# EAGLE design POWERSUPPLY (EAGLE 9.6.2)
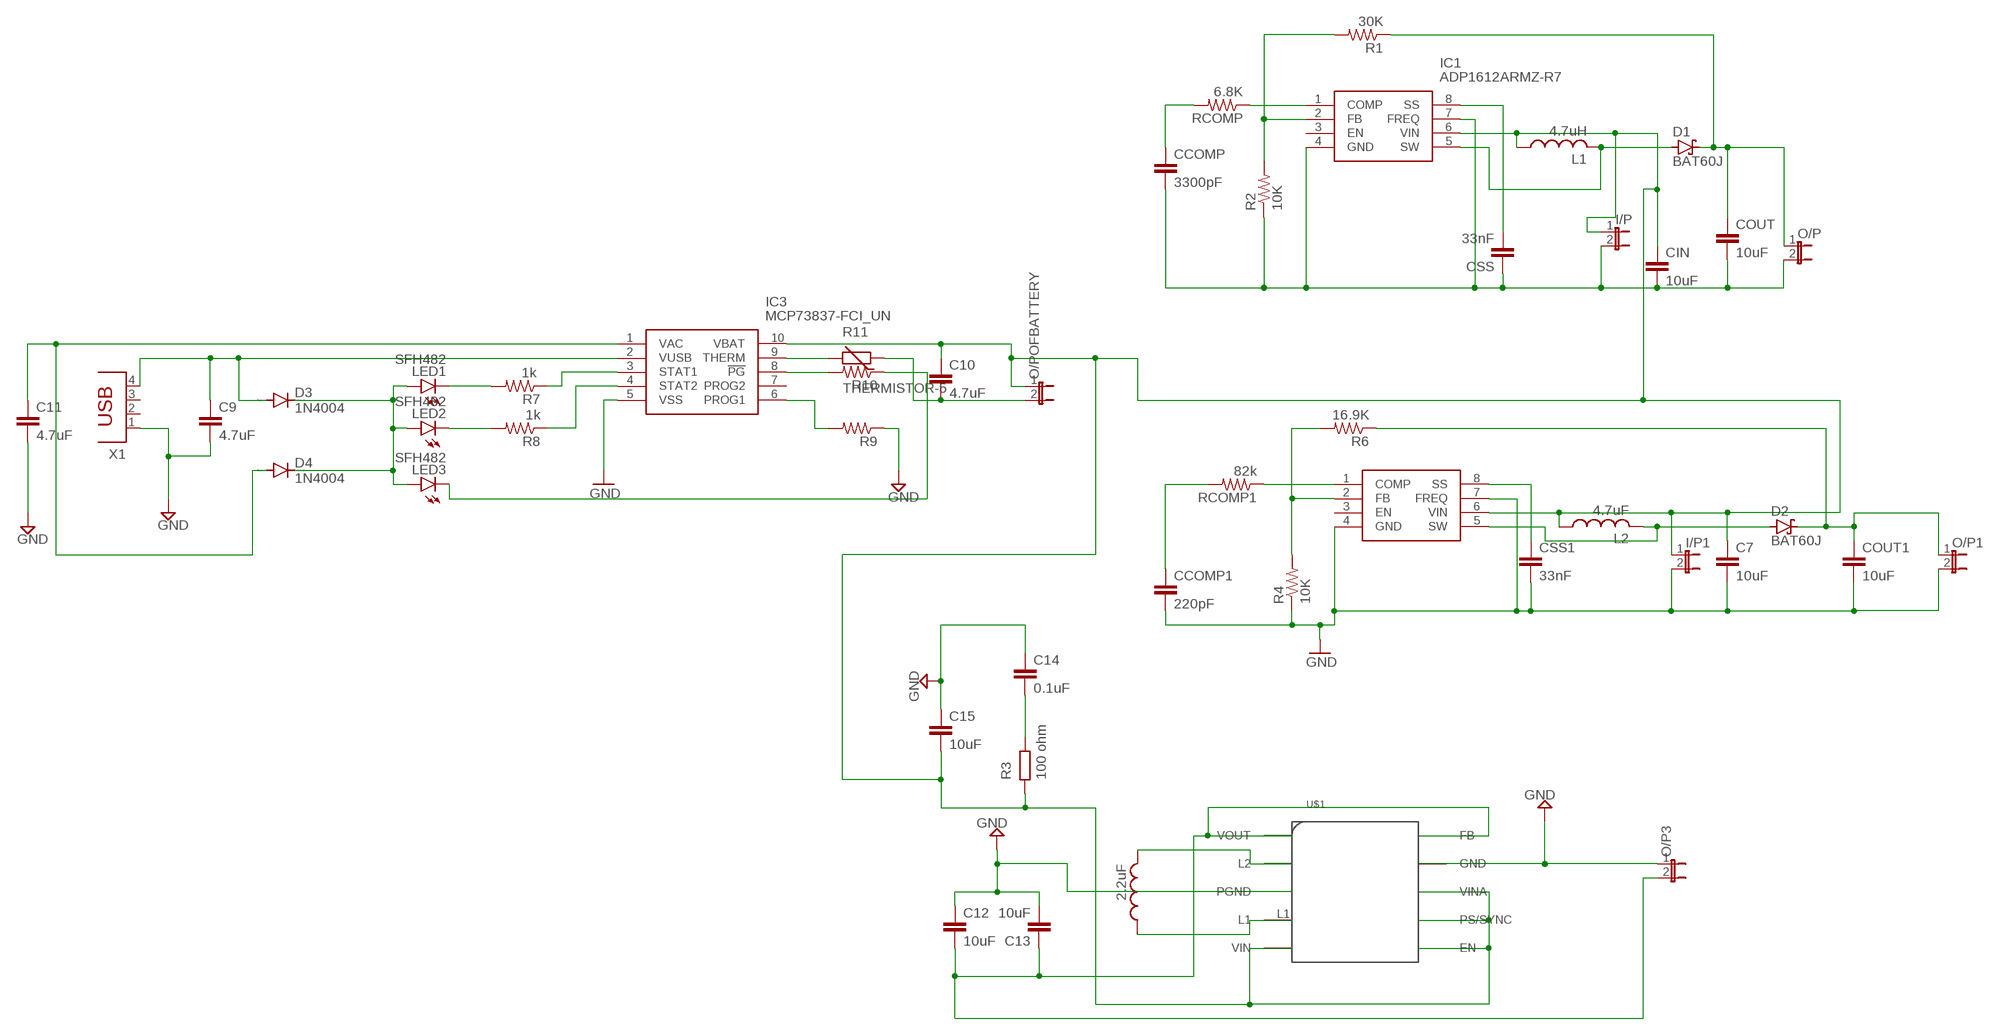
[diagram p0: schematic, sheet 1]

## Parts
C7  10uF  C2,5-3  [C2.5-3]
C9  4.7uF  C2,5-3  [C2.5-3]
C10  4.7uF  C2,5-3  [C2.5-3]
C11  4.7uF  C2,5-3  [C2.5-3]
C12  10uF  C2,5-3  [C2.5-3]
C13  10uF  C2,5-3  [C2.5-3]
C14  0.1uF  C2,5-3  [C2.5-3]
C15  10uF  C2,5-3  [C2.5-3]
CCOMP  3300pF  C2,5-3  [C2.5-3]
CCOMP1  220pF  C2,5-3  [C2.5-3]
CIN  10uF  C2,5-3  [C2.5-3]
COUT  10uF  C2,5-3  [C2.5-3]
COUT1  10uF  C2,5-3  [C2.5-3]
CSS  33nF  C2,5-3  [C2.5-3]
CSS1  33nF  C2,5-3  [C2.5-3]
D1  BAT60J  [SOD323_ST]
D2  BAT60J  [SOD323_ST]
D3  1N4004  [DO41-10]
D4  1N4004  [DO41-10]
I/P  JP1E  [JP1]
I/P1  JP1E  [JP1]
IC1  ADP1612ARMZ-R7  [SOP65P490X110-8N]
IC2  ADP1613ARMZ-R7  [SOP65P490X110-8N]
IC3  MCP73837-FCI_UN  [SOP50P490X110-10N]
L1  4.7uH  L-US0207/5V  [0207/5V]
L2  4.7uF  L-US0207/5V  [0207/5V]
L3  2.2uF  L-US0207/5V  [0207/5V]
LED1  SFH482  [SFH482]
LED2  SFH482  [SFH482]
LED3  SFH482  [SFH482]
O/P  JP1E  [JP1]
O/P1  3.3V  JP1E  [JP1]
O/P3  JP1E  [JP1]
O/POFBATTERY  JP1E  [JP1]
R1  30K  R-US_0204/7  [0204/7]
R2  10K  R-US_0204/7  [0204/7]
R3  100 ohm  R  (no package)
R4  10K  R-US_0204/7  [0204/7]
R6  16.9K  R-US_0204/7  [0204/7]
R7  1k  R-US_0204/7  [0204/7]
R8  1k  R-US_0204/7  [0204/7]
R9  R-US_0204/7  [0204/7]
R10  R-US_0204/7  [0204/7]
R11  THERMISTOR-5  [R-5]
RCOMP  6.8K  R-US_0204/7  [0204/7]
RCOMP1  82k  R-US_0204/7  [0204/7]
U$1  TPS63002  [TPS63002]
X1  PN87520  [PN87520]

## Nets
GND: C7.2 C9.2 C11.2 C12.1 C13.2 C14.1 C15.1 CCOMP1.2 COUT1.2 CSS1.2 I/P1.2 IC2.4(GND) IC2.7(FREQ) IC3.5(VSS) O/P1.2 O/P3.1 R4.1 R9.1 U$1.GND U$1.PGND X1.1
N$1: CCOMP.1 RCOMP.2
N$2: IC1.1(COMP) RCOMP.1
N$3: CCOMP.2 CIN.2 COUT.2 CSS.1 I/P.2 IC1.4(GND) IC1.7(FREQ) O/P.2 R2.1
N$4: IC1.2(FB) R1.2 R2.2
N$5: CSS.2 IC1.8(SS)
N$6: IC3.4(STAT2) R8.1
N$7: C7.1 C10.1 C15.2 CIN.1 I/P1.1 I/P.1 IC1.6(VIN) IC2.6(VIN) IC3.10(VBAT) L1.1 L2.1 O/POFBATTERY.1 R3.1 U$1.EN U$1.PS/SYNC U$1.VIN U$1.VINA
N$8: D1.A IC1.5(SW) L1.2
N$9: COUT.1 D1.C O/P.1 R1.1
N$10: CCOMP1.1 RCOMP1.2
N$11: IC2.1(COMP) RCOMP1.1
N$12: IC2.2(FB) R4.2 R6.2
N$13: CSS1.1 IC2.8(SS)
N$14: D2.A IC2.5(SW) L2.2
N$15: C11.1 D4.A IC3.1(VAC)
N$16: L3.2 U$1.L2
N$17: COUT1.1 D2.C O/P1.1 R6.1
N$19: C9.1 D3.A IC3.2(VUSB) X1.4
N$20: C12.2 C13.1 O/P3.2 U$1.FB U$1.VOUT
N$22: IC3.3(STAT1) R7.1
N$25: D3.C D4.C LED1.A LED2.A LED3.A
N$26: LED1.K(C) R7.2
N$27: LED2.K(C) R8.2
N$28: LED3.K(C) R10.1
N$30: IC3.6(PROG1) R9.2
N$31: L3.1 U$1.L1
N$32: IC3.9(THERM) R11.2
N$33: IC3.8(!PG) R10.2
N$34: C10.2 O/POFBATTERY.2 R11.1
N$38: C14.2 R3.2
Unconnected: IC1.3(EN) IC2.3(EN) IC3.7(PROG2) X1.2 X1.3

## Library data of the parts
C7 C9-C15 CCOMP CCOMP1 CIN COUT COUT1 CSS CSS1 = capacitor-wima:C: CAPACITOR naming: grid - package width
D1 D2 = diode:BAT60J: Schottky barrier diode Source: www.st.com, BAT60J.pdf
D3 D4 = diode:1N4004: DIODE general purpose rectifier, 1 A
I/P I/P1 O/P O/P1 O/P3 O/POFBATTERY = jumper:JP1E: JUMPER
IC1 = ADP1612ARMZ-R7:ADP1612ARMZ-R7: Analog Devices ADP1612ARMZ-R7, Step Up DC-DC Converter, 1.9A, Adjustable, 5.5 20 V, 8-Pin MSOP Source: Datasheet <http://uk.rs-online.com/web/p/products/7427727P>; ARROW_PART_NUMBER: ADP1612ARMZ-R7; ARROW_PRICE-STOCK: https://www.arrow.com/en/products/adp1612armz-r7/analog-devices; DESCRIPTION: Analog Devices ADP1612ARMZ-R7, Step Up DC-DC Converter, 1.9A, Adjustable, 5.5 20 V, 8-Pin MSOP; HEIGHT: 1.1mm; MANUFACTURER_NAME: Analog Devices; MANUFACTURER_PART_NUMBER: ADP1612ARMZ-R7; MOUSER_PART_NUMBER: 584-ADP1612ARMZ-R7; MOUSER_PRICE-STOCK: https://www.mouser.com/Search/Refine.aspx?Keyword=584-ADP1612ARMZ-R7
IC2 = ADP1613ARMZ-R7:ADP1613ARMZ-R7: Analog Devices ADP1613ARMZ-R7, Step Up DC-DC Converter, 2.5A, Adjustable, 5.5 20 V, 8-Pin MSOP Source: Datasheet <https://datasheet.lcsc.com/szlcsc/Analog-Devices-ADI-ADP1613ARMZ-R7_C132279.pdf>; ARROW_PART_NUMBER: ADP1613ARMZ-R7; ARROW_PRICE-STOCK: https://www.arrow.com/en/products/adp1613armz-r7/analog-devices; DESCRIPTION: Analog Devices ADP1613ARMZ-R7, Step Up DC-DC Converter, 2.5A, Adjustable, 5.5 20 V, 8-Pin MSOP; HEIGHT: 1.1mm; MANUFACTURER_NAME: Analog Devices; MANUFACTURER_PART_NUMBER: ADP1613ARMZ-R7; MOUSER_PART_NUMBER: 584-ADP1613ARMZ-R7; MOUSER_PRICE-STOCK: https://www.mouser.co.uk/ProductDetail/Analog-Devices/ADP1613ARMZ-R7?qs=WIvQP4zGanhDtCwLTFW%252BRw%3D%3D
IC3 = MCP73837-FCI_UN:MCP73837-FCI_UN: Li-Ion Charger USB/DC 4.2V 1A PG MSOP10 Source: Datasheet <http://ww1.microchip.com/downloads/en/DeviceDoc/22071B.pdf>; ARROW_PART_NUMBER: MCP73837-FCI/UN; ARROW_PRICE-STOCK: https://www.arrow.com/en/products/mcp73837-fciun/microchip-technology; DESCRIPTION: Li-Ion Charger USB/DC 4.2V 1A PG MSOP10; HEIGHT: 1.1mm; MANUFACTURER_NAME: Microchip; MANUFACTURER_PART_NUMBER: MCP73837-FCI/UN; MOUSER_PART_NUMBER: 579-MCP73837-FCI/UN; MOUSER_PRICE-STOCK: https://www.mouser.co.uk/ProductDetail/Microchip-Technology/MCP73837-FCI-UN?qs=hH%252BOa0VZEiDKGj395FRsiw%3D%3D
L1-L3 = rcl:L-US: INDUCTOR, American symbol; SPICEPREFIX: L
LED1-LED3 = led:SFH482: IR LED infrared emitting diode, Infineon
R1 R2 R4 R6-R10 RCOMP RCOMP1 = rcl:R-US_: RESISTOR, American symbol; SPICEPREFIX: R
R3 = ngspice-simulation:R: RESISTOR
R11 = varistor:THERMISTOR: THERMISTOR
U$1 = TPS63002:TPS63002
X1 = con-berg:PN87520: BERG USB connector; OC_FARNELL: unknown; OC_NEWARK: unknown

## Board
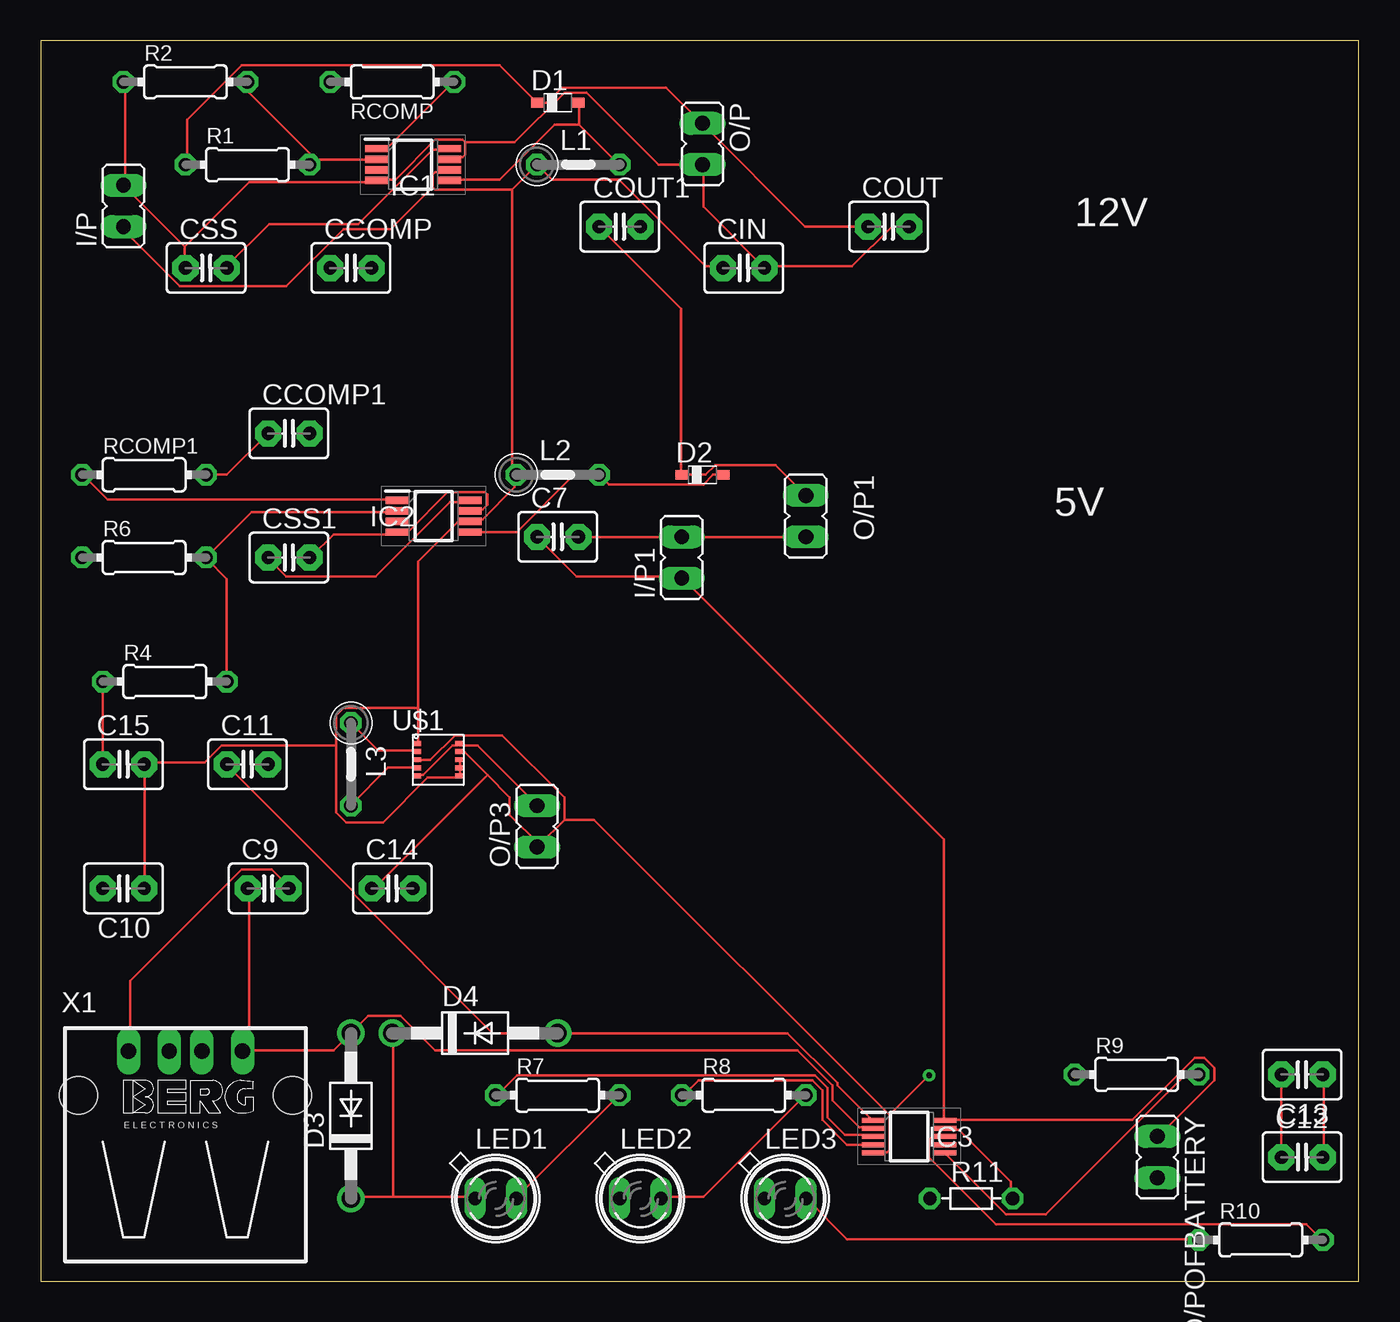
[diagram p1: board, top side]
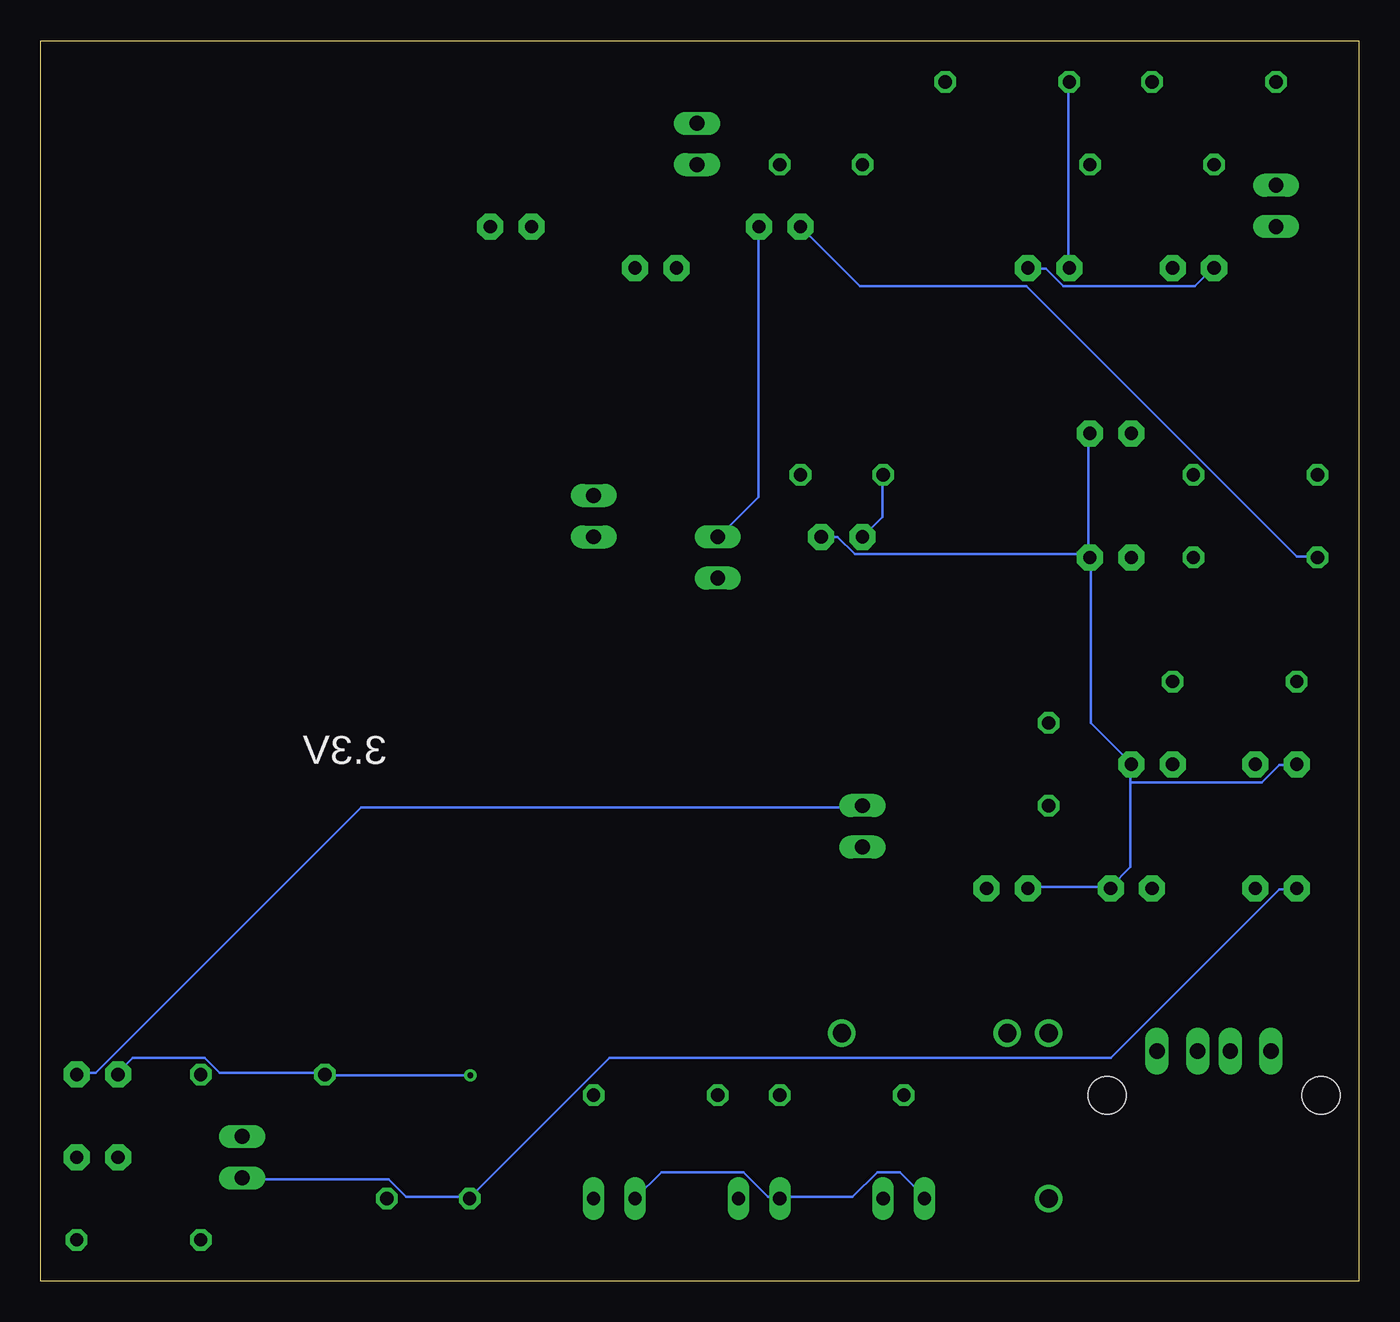
[diagram p2: board, bottom side, seen from below]

Size 80.95 x 76.19 mm. Coordinates in mm from the lower left corner, seen from the top.
Outline: 0,0 80.95,0 80.95,76.19 0,76.19 0,0
Copper layers (1*16): Top 0.035mm / dielectric 1.5mm / Bottom 0.035mm
Design rules "default": minimum track width 6mil, minimum drill 0.35mm, track to track 6mil, track to pad 6mil, pad to pad 6mil, via to via 6mil, smd to smd 6mil, copper to edge 40mil, drill to drill 6mil, minimum pad ring 10mil, minimum via ring 8mil, stop-mask expansion 4mil, vias tented up to drill 0mil, thermal gap 10mil

### Footprints (pad centres in the part's own frame; a part is rotated, then mirrored left to right if it is on the bottom)
C2.5-3 = drill 0.813 pad 1.6 octagon: 1 -1.27,0; 2 1.27,0
SOD323_ST = smd 0.8 x 0.6: A 1.25,0; C -1.25,0
DO41-10 = drill 1.118: A 5.08,0; C -5.08,0
JP1 = drill 0.914 long: 1 0,-1.27; 2 0,1.27
SOP65P490X110-8N = smd 1.45 x 0.45: 1 -2.225,0.975; 2 -2.225,0.325; 3 -2.225,-0.325; 4 -2.225,-0.975; 5 2.225,-0.975; 6 2.225,-0.325; 7 2.225,0.325; 8 2.225,0.975
SOP50P490X110-10N = smd 1.4 x 0.3: 1 -2.2,1; 2 -2.2,0.5; 3 -2.2,0; 4 -2.2,-0.5; 5 -2.2,-1; 6 2.2,-1; 7 2.2,-0.5; 8 2.2,0; 9 2.2,0.5; 10 2.2,1
0207/5V = drill 0.813 octagon: 1 -2.54,0; 2 2.54,0
SFH482 = drill 0.813 long: A -1.27,0; K 1.27,0
0204/7 = drill 0.813 octagon: 1 -3.81,0; 2 3.81,0
R-5 = drill 0.813 octagon: 1 -2.54,0; 2 2.54,0
TPS63002 = smd 0.5 x 0.3: EN 2.85,0.55; FB 2.85,2.55; GND 2.85,2.05; L1 0.25,2.05; L2 0.25,1.05; PGND 0.25,1.55; PS/SYNC 2.85,1.05; VIN 0.25,2.55; VINA 2.85,1.55; VOUT 0.25,0.55
PN87520 = drill 0.95 long: 1 -3.5,2.71; 2 -1,2.71; 3 1,2.71; 4 3.5,2.71 | hole 2.3: -6.57,0; 6.57,0

### Placement (x,y rotation side)
C7  31.75,45.72 0 top
C9  13.97,24.13 0 top
C10  5.08,24.13 180 top
C11  12.7,31.75 0 top
C12  77.47,7.62 0 top
C13  77.47,12.7 180 top
C14  21.59,24.13 0 top
C15  5.08,31.75 0 top
CCOMP  19.05,62.23 0 top
CCOMP1  15.24,52.07 0 top
CIN  43.18,62.23 0 top
COUT  52.07,64.77 0 top
COUT1  35.56,64.77 0 top
CSS  10.16,62.23 0 top
CSS1  15.24,44.45 0 top
D1  31.75,72.39 0 top
D2  40.64,49.53 0 top
D3  19.05,10.16 90 top
D4  26.67,15.24 0 top
I/P  5.08,66.04 0 top
I/P1  39.37,44.45 0 top
IC1  22.86,68.58 0 top
IC2  24.13,46.99 0 top
IC3  53.34,8.89 0 top
L1  33.02,68.58 0 top
L2  31.75,49.53 0 top
L3  19.05,31.75 270 top
LED1  27.94,5.08 0 top
LED2  36.83,5.08 0 top
LED3  45.72,5.08 0 top
O/P  40.64,69.85 180 top
O/P1  46.99,46.99 180 top
O/P3  30.48,27.94 0 top
O/POFBATTERY  68.58,7.62 180 top
R1  12.7,68.58 0 top
R2  8.89,73.66 0 top
R4  7.62,36.83 0 top
R6  6.35,44.45 0 top
R7  31.75,11.43 0 top
R8  43.18,11.43 0 top
R9  67.31,12.7 0 top
R10  74.93,2.54 0 top
R11  57.15,5.08 0 top
RCOMP  21.59,73.66 180 top
RCOMP1  6.35,49.53 0 top
U$1  22.86,30.48 0 top
X1  8.89,11.43 0 top

### Tracks (layer width: path | path; a pad name or v marks a point on that pad's centre or on a via)
GND  (via drill 0.35)
  Top 0.152: C13.2 C12.1 | 32.16,28.35 32.16,29.72 28.35,33.53 25.45,33.53 23.93,32 23.16,32 U$1.PGND | 30.63,26.82 32.16,28.35 | 27.43,31.09 28.8,29.72 28.8,28.65 30.63,26.82 | 27.43,31.09 26.06,32.46 25.76,32.46 U$1.GND | 30.63,26.82 O/P3.1 | 52.12,10.21 52.12,8.08 51.97,7.92 51.21,7.92 IC3.5 | 52.12,10.21 33.98,28.35 32.16,28.35 | 52.12,10.21 v54.56,12.65 | C7.2 I/P1.2 O/P1.2 | CSS1.2 16.61,44.5 17.98,45.87 21.79,45.87 IC2.4 21.95,46.02 22.55,46.02 24.99,48.46 27.28,48.46 27.43,48.31 27.43,47.7 27.13,47.4 26.36,47.4 IC2.7 | C15.1 R4.1 | X1.1 5.49,14.17 5.49,18.44 12.34,25.3 14.17,25.3 15.24,24.23 C9.2 | 27.43,31.09 20.42,24.08 C14.1
  Bottom 0.152: C13.2 76.2,12.8 75.29,13.72 70.87,13.72 69.95,12.8 63.55,12.8 R9.1 63.4,12.65 v54.56,12.65 | COUT1.2 36.88,64.77 36.88,48.16 39.32,45.72 I/P1.2 | 16.61,44.65 16.61,44.5 CSS1.2 | 16.61,44.65 16.61,51.97 CCOMP1.2 | 15.24,24.23 20.27,24.23 C14.1 | 14.02,30.63 14.02,25.45 15.24,24.23 | 14.02,30.63 14.02,31.7 C11.2 14.02,31.85 16.46,34.29 16.46,44.35 CSS1.2 | 15.24,24.23 C9.2 | 14.02,30.63 5.94,30.63 4.88,31.7 3.81,31.7 C15.1 | C7.2 32,45.72 30.94,44.65 16.61,44.65 | 16.61,44.65 CSS1.2
N$1
  Bottom 0.152: RCOMP.2 17.83,73.61 17.83,62.33 CCOMP.1
N$2
  Top 0.152: IC1.1 20.73,69.65 21.34,69.65 25.3,73.61 RCOMP.1
N$3
  Top 0.152: COUT.2 52.27,64.77 49.84,62.33 44.5,62.33 CIN.2 40.69,65.99 40.69,68.58 O/P.2 37.95,68.58 33.53,73 32.16,73 29.11,69.95 26.06,69.95 | 26.06,69.95 25.91,70.1 24.23,70.1 21.79,67.67 20.73,67.67 IC1.4 20.57,67.51 12.8,67.51 8.84,63.55 | 26.06,69.95 26.06,69.19 25.91,69.04 25.15,69.04 IC1.7 | R2.1 5.18,73.61 5.18,67.36 I/P.2 8.84,63.55 | 8.84,63.55 8.84,62.33 CSS.1
  Bottom 0.152: CCOMP.2 20.27,62.18 19.2,62.18 18.14,61.11 10.06,61.11 8.99,62.18 CSS.1
N$4
  Top 0.152: 16.92,68.89 20.57,68.89 IC1.2 | 16.92,68.89 16.61,68.58 R1.2 16.92,68.89 | 16.92,68.89 12.8,73 12.8,73.61 R2.2
N$5
  Top 0.152: IC1.8 24.99,69.49 24.08,69.49 19.51,64.92 14.02,64.92 11.43,62.33 CSS.2
N$6
  Top 0.152: IC3.4 51.05,8.38 49.53,8.38 48.01,9.91 48.01,11.73 47.4,12.34 40.39,12.34 39.47,11.43 R8.1
N$7
  Top 0.152: 24.08,67.21 24.08,67.97 24.23,68.12 24.99,68.12 IC1.6 | 24.08,67.21 24.23,67.06 28.96,67.06 | 28.96,67.06 L1.1 31.39,67.67 35.51,67.67 40.84,62.33 41.91,62.33 CIN.1 | 24.08,67.21 21.49,64.62 18.59,64.62 15.09,61.11 8.53,61.11 5.18,64.47 5.18,64.77 I/P.1 | C10.1 6.4,24.23 6.4,31.7 C15.2 6.4,31.85 10.06,31.85 11.12,32.92 18.14,32.92 | U$1.VINA 25.76,32 25.76,31.55 U$1.PS/SYNC 25.76,31.39 25.76,31.09 U$1.EN 25.6,30.94 23.77,30.94 21.03,28.19 18.75,28.19 18.14,28.8 18.14,32.92 | 23.16,35.2 23.16,44.2 25.6,46.63 26.21,46.63 IC2.6 26.36,46.79 27.13,46.79 29.11,48.77 29.11,49.53 | 23.16,35.2 23.16,33.07 U$1.VIN | 18.14,32.92 18.14,34.75 18.59,35.2 23.16,35.2 | O/POFBATTERY.1 68.58,8.84 72.08,12.34 72.08,13.11 71.48,13.72 70.87,13.72 67.06,9.91 55.63,9.91 IC3.10 55.47,9.91 55.47,27.13 39.47,43.13 I/P1.1 39.32,43.28 32.92,43.28 C7.1 | 28.96,67.06 28.96,49.68 29.11,49.53 | 29.11,49.53 L2.1
  Bottom 0.152: C7.1 29.26,46.94 29.26,49.53 L2.1
N$8
  Top 0.152: 33.07,71.02 33.07,72.39 D1.A | 33.07,71.02 35.51,68.58 L1.2 | 33.07,71.02 31.55,71.02 28.19,67.67 25.15,67.67 IC1.5
N$9
  Top 0.152: R1.1 8.99,68.58 8.99,71.32 12.34,74.68 28.19,74.68 30.48,72.39 D1.C 31.09,72.39 32,73.3 38.41,73.3 40.54,71.17 O/P.1 40.69,71.02 46.94,64.77 COUT.1
N$10
  Top 0.152: RCOMP1.2 11.43,49.53 CCOMP1.1
N$11
  Top 0.152: IC2.1 21.79,48.01 4.12,48.01 2.59,49.53 RCOMP1.1
N$12
  Top 0.152: IC2.2 21.79,47.24 12.95,47.24 R6.2 10.21,44.35 11.43,43.13 R4.2
N$13
  Top 0.152: IC2.8 26.21,47.85 25.15,47.85 20.57,43.28 15.09,43.28 14.02,44.35 CSS1.1
N$14
  Top 0.152: D2.A 41.3,49.53 40.69,48.92 34.9,48.92 L2.2 32.77,49.53 29.26,46.02 IC2.5
N$15
  Top 0.152: IC3.1 51.05,9.91 48.92,12.04 48.92,12.19 45.87,15.24 D4.A 27.74,15.24 19.2,23.77 19.2,23.93 11.43,31.7 C11.1
N$16
  Top 0.152: U$1.L2 23.01,31.55 21.34,31.55 19.05,29.26 L3.2
N$17
  Top 0.152: O/P1.1 45.11,50.14 41.45,50.14 40.84,49.53 D2.C 39.32,49.53 39.32,59.74 COUT1.1
  Bottom 0.152: COUT1.1 30.63,61.11 20.42,61.11 3.81,44.5 2.59,44.5 R6.1
N$19
  Top 0.152: IC3.2 51.05,9.45 50.29,9.45 48.62,11.12 48.62,12.04 46.48,14.17 24.23,14.17 22.1,16.31 20.12,16.31 D3.A 17.98,14.17 12.8,14.17 | 12.8,14.17 12.5,14.17 X1.4 12.8,14.17 | 12.8,14.17 12.8,24.08 C9.1
N$20
  Top 0.152: C12.2 78.79,7.62 78.79,12.65 C13.1 | U$1.VOUT 23.16,31.09 23.47,31.09 25.3,32.92 25.6,32.92 U$1.FB 25.76,32.92 26.82,32.92 30.48,29.26 O/P3.2
  Bottom 0.152: C13.1 78.64,12.8 77.57,12.8 61.27,29.11 30.48,29.11 O/P3.2
N$22
  Top 0.152: IC3.3 51.05,8.99 49.38,8.99 48.31,10.06 48.31,11.89 47.55,12.65 29.26,12.65 28.04,11.43 R7.1
N$25
  Top 0.152: 21.64,5.18 19.05,5.18 D3.C | 21.64,5.18 26.67,5.18 LED1.A | 21.64,5.18 21.64,15.24 D4.C
  Bottom 0.152: LED3.A 42.82,6.71 37.8,6.71 36.27,5.18 35.66,5.18 LED2.A 35.51,5.18 31.09,5.18 29.57,6.71 28.19,6.71 26.67,5.18 LED1.A
N$26
  Top 0.152: LED1.K 29.26,5.18 35.51,11.43 R7.2
N$27
  Top 0.152: LED2.K 38.1,5.18 40.69,5.18 46.94,11.43 R8.2
N$28
  Top 0.152: R10.1 71.02,2.59 49.53,2.59 47.09,5.03 LED3.K
N$30
  Top 0.152: IC3.6 55.63,7.77 59.28,4.12 61.72,4.12 70.26,12.65 71.02,12.65 R9.2
N$31
  Top 0.152: L3.1 20.73,32.61 23.01,32.61 U$1.L1
N$32
  Top 0.152: IC3.9 55.63,9.3 56.39,9.3 59.59,6.1 59.59,5.18 R11.2
N$33
  Top 0.152: IC3.8 55.47,8.84 54.71,8.84 54.56,8.69 54.56,7.62 58.67,3.5 77.72,3.5 78.64,2.59 R10.2
N$34
  Bottom 0.152: O/POFBATTERY.2 68.58,6.25 59.59,6.25 58.52,5.18 54.71,5.18 R11.1 54.56,5.18 46.02,13.72 15.24,13.72 4.88,24.08 3.81,24.08 C10.2

### Text on the board
bPlace: 3.3V
tNames: 12V | 5V